# Altium schematic sheet USB.SchDoc
size A; SheetNumber: 4; SheetTotal: 6
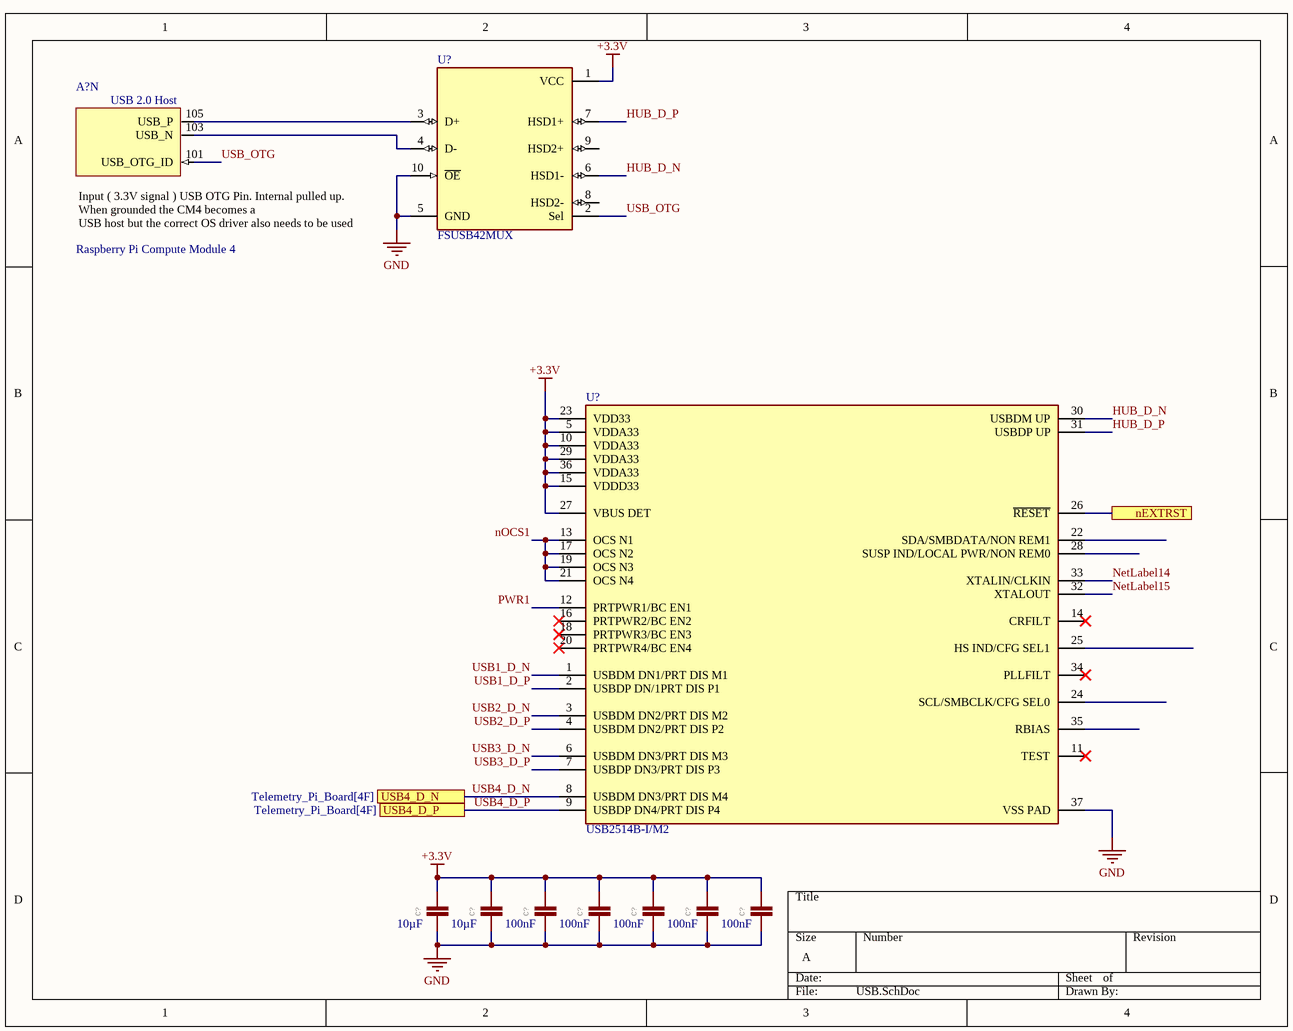
[diagram p0: USB.SchDoc]

## Parts
(Parts that share a designator on the sheet are numbered #1, #2 ... from top to bottom, then left to right.)
A?  Raspberry Pi Compute Module 4  [CM4-F40C-100DS-0.4v_1.5mm_0mm]  (part N of 21)  (no BOM)
C?#1  CAPACITANCE: 10µF  [0603-CAP]  (hidden comment: Capacitor, Non-Polarized  VJ...1BC Series Datasheet  Samsung Datasheet  Walsin Datasheet  GRM188R61A226ME15D  GRM188R61E106MA73D  885012006013  2220Y6300105KXTWS2  Yageo Class 2, X5R  TDK C Series  AVX Automotive MLCC   KEMET X7R Series  Kyocera AVX  GRM21BR61H  C1812W104KDRACTU)
C?#2  CAPACITANCE: 10µF  [0603-CAP]  (hidden comment: Capacitor, Non-Polarized  VJ...1BC Series Datasheet  Samsung Datasheet  Walsin Datasheet  GRM188R61A226ME15D  GRM188R61E106MA73D  885012006013  2220Y6300105KXTWS2  Yageo Class 2, X5R  TDK C Series  AVX Automotive MLCC   KEMET X7R Series  Kyocera AVX  GRM21BR61H  C1812W104KDRACTU)
C?#3  CAPACITANCE: 100nF  [0603-CAP]  (hidden comment: Capacitor, Non-Polarized  VJ...1BC Series Datasheet  Samsung Datasheet  Walsin Datasheet  GRM188R61A226ME15D  GRM188R61E106MA73D  885012006013  2220Y6300105KXTWS2  Yageo Class 2, X5R  TDK C Series  AVX Automotive MLCC   KEMET X7R Series  Kyocera AVX  GRM21BR61H  C1812W104KDRACTU)
C?#4  CAPACITANCE: 100nF  [0603-CAP]  (hidden comment: Capacitor, Non-Polarized  VJ...1BC Series Datasheet  Samsung Datasheet  Walsin Datasheet  GRM188R61A226ME15D  GRM188R61E106MA73D  885012006013  2220Y6300105KXTWS2  Yageo Class 2, X5R  TDK C Series  AVX Automotive MLCC   KEMET X7R Series  Kyocera AVX  GRM21BR61H  C1812W104KDRACTU)
C?#5  CAPACITANCE: 100nF  [0603-CAP]  (hidden comment: Capacitor, Non-Polarized  VJ...1BC Series Datasheet  Samsung Datasheet  Walsin Datasheet  GRM188R61A226ME15D  GRM188R61E106MA73D  885012006013  2220Y6300105KXTWS2  Yageo Class 2, X5R  TDK C Series  AVX Automotive MLCC   KEMET X7R Series  Kyocera AVX  GRM21BR61H  C1812W104KDRACTU)
C?#6  CAPACITANCE: 100nF  [0603-CAP]  (hidden comment: Capacitor, Non-Polarized  VJ...1BC Series Datasheet  Samsung Datasheet  Walsin Datasheet  GRM188R61A226ME15D  GRM188R61E106MA73D  885012006013  2220Y6300105KXTWS2  Yageo Class 2, X5R  TDK C Series  AVX Automotive MLCC   KEMET X7R Series  Kyocera AVX  GRM21BR61H  C1812W104KDRACTU)
C?#7  CAPACITANCE: 100nF  [0603-CAP]  (hidden comment: Capacitor, Non-Polarized  VJ...1BC Series Datasheet  Samsung Datasheet  Walsin Datasheet  GRM188R61A226ME15D  GRM188R61E106MA73D  885012006013  2220Y6300105KXTWS2  Yageo Class 2, X5R  TDK C Series  AVX Automotive MLCC   KEMET X7R Series  Kyocera AVX  GRM21BR61H  C1812W104KDRACTU)
U?#1  FSUSB42MUX  [FP-846AP-MFG]
U?#2  USB2514B-I/M2  [FP-36SQFN-3706-6x6B-IPC_B]

## Ports
nEXTRST, USB4_D_N (see Telemetry_Pi_Board[4F]), USB4_D_P (see Telemetry_Pi_Board[4F])

## Nets
+3.3V: C?#1.1 C?#2.1 C?#3.1 C?#4.1 C?#5.1 C?#6.1 C?#7.1 U?#1.1(VCC) U?#2.5(VDDA33) U?#2.10(VDDA33) U?#2.15(VDDD33) U?#2.23(VDD33) U?#2.27(VBUS_DET) U?#2.29(VDDA33) U?#2.36(VDDA33)
GND: C?#1.2 C?#2.2 C?#3.2 C?#4.2 C?#5.2 C?#6.2 C?#7.2 U?#1.5(GND) U?#1.10(~{OE}) U?#2.37(VSS_PAD)
HUB_D_N: U?#1.6(HSD1-) U?#2.30(USBDM_UP)
HUB_D_P: U?#1.7(HSD1+) U?#2.31(USBDP_UP)
NetLabel14: U?#2.33(XTALIN/CLKIN)
NetLabel15: U?#2.32(XTALOUT)
nEXTRST: U?#2.26(~{RESET}) ; port nEXTRST
nOCS1: U?#2.13(OCS_N1) U?#2.17(OCS_N2) U?#2.19(OCS_N3) U?#2.21(OCS_N4)
PWR1: U?#2.12(PRTPWR1/BC_EN1)
USB1_D_N: U?#2.1(USBDM_DN1/PRT_DIS_M1)
USB1_D_P: U?#2.2(USBDP_DN/1PRT_DIS_P1)
USB2_D_N: U?#2.3(USBDM_DN2/PRT_DIS_M2)
USB2_D_P: U?#2.4(USBDM_DN2/PRT_DIS_P2)
USB3_D_N: U?#2.6(USBDM_DN3/PRT_DIS_M3)
USB3_D_P: U?#2.7(USBDP_DN3/PRT_DIS_P3)
USB4_D_N: U?#2.8(USBDM_DN3/PRT_DIS_M4) ; port USB4_D_N
USB4_D_P: U?#2.9(USBDP_DN4/PRT_DIS_P4) ; port USB4_D_P
USB_OTG: A?.101(USB_OTG_ID) U?#1.2(Sel)
NetA?_103: A?.103(USB_N) U?#1.4(D-)
NetA?_105: A?.105(USB_P) U?#1.3(D+)

Not connected (* = marked no-connect by the designer): U?#1 8(HSD2-) 9(HSD2+); U?#2 11(TEST)* 14(CRFILT)* 16(PRTPWR2/BC_EN2)* 18(PRTPWR3/BC_EN3)* 20(PRTPWR4/BC_EN4)* 22(SDA/SMBDATA/NON_REM1) 24(SCL/SMBCLK/CFG_SEL0) 25(HS_IND/CFG_SEL1) 28(SUSP_IND/LOCAL_PWR/NON_REM0) 34(PLLFILT)* 35(RBIAS)

## Notes on the sheet
- (in symbol CM4, part N) USB 2.0 Host; Input ( 3.3V signal ) USB OTG Pin. Internal pulled up. When grounded the CM4 becomes a / USB host but the correct OS driver also needs to be used

## Library data of the parts
A? = CM4: Raspberry Pi Compute Module 4 by Amornthep Phunsin
C?#1 C?#2 = CAPACITOR_?_*0603: MPN: CC0603KRX7R0BB104; MPN: CC0603KRX7R0BB103; MPN: C0603C823K8RACTU; MANUFACTURER: Vishay Vitramon; MPN: VJ0603Y104JXQPW1BC; MPN: VJ0603Y224JXQCW1BC; MPN: CC0603KRX7R6BB103; MPN: VJ0603A150FXQPW1BC; MPN: CC0603KRX7R6BB105; MANUFACTURER: Murata Electronics; MANUFACTURER: Würth Elektronik; MPN: 885012006016; MPN: 885012206012; MANUFACTURER: Samsung Electro-Mechanics; MPN: CL10A475KP8NNNC; MPN: C0603C683K8RACTU; MPN: 0201ZA820JAT2A; MPN: CL10B104KA8NNNC; MANUFACTURER: Walsin Technology Corporation; MPN: 0603B224K250CT; MPN: CC0603KRX7R8BB122; MPN: CL10B105KA8NNNC; MANUFACTURER: TDK Corporation; MPN: C1608X5R1E475K080AC; MPN: 06033C473K4Z2A; MANUFACTURER: Taiyo Yuden; MPN: GMK107B7104KAHT; MPN: C1608X7R1V224K080AB; MPN: C1608X7R1V105K080AE; MPN: CC0603KRX7R9BB104; MPN: C1608C0G1H103J080AA; MPN: UMK107BJ105KA-T; MPN: CL10B471JB8NNNC; GateName_1: G$1; DeviceName: 0603; DKPN: 311-1523-1-ND; MOPN: 603-CC603KRX7R0BB104; TOLERANCE: 10%; VOLTAGE: 100V; CAPACITANCE: 10nF; DKPN: 311-1788-1-ND; MOPN: 603-CC603KRX7R0BB103; CAPACITANCE: 0.082µF; DKPN: 399-17417-2-ND; MOPN: 80-C0603C823K8R; VOLTAGE: 10V; CAPACITANCE: 0.1µF; DKPN: 720-1688-1-ND; MOPN: 77-VJ0603Y104JXQPBC; TOLERANCE: 5%; CAPACITANCE: 0.22µF; DKPN: 720-VJ0603Y224JXQCW1BCTR-ND; MOPN: 77-VJ0603Y224JXQCBC; DKPN: 311-4054-1-ND; MOPN: 603-CC603KRX7R6BB103; CAPACITANCE: 15pF; DKPN: 720-VJ0603A150FXQPW1BCCT-ND; MOPN: 77-VJ0603A150FXQPBC; TOLERANCE: 1%; CAPACITANCE: 1µF; DKPN: 311-1796-1-ND; MOPN: 603-CC603KRX7R6BB105; CAPACITANCE: 22µF; DKPN: 490-10476-1-ND; MOPN: 81-GRM188R61A226ME5D; TOLERANCE: 20%; CAPACITANCE: 3.3nF; DKPN: 732-7759-1-ND; MOPN: 710-885012006016; CAPACITANCE: 4.7nF; DKPN: 732-7931-1-ND; MOPN: 710-885012206012; CAPACITANCE: 4.7µF; DKPN: 1276-1044-1-ND; MOPN: 187-CL10A475KP8NNNC; CAPACITANCE: 680pF; DKPN: 732-7757-1-ND; MOPN: 710-885012006013; CAPACITANCE: 68nF; DKPN: 399-C0603C683K8RAC7867CT-ND; MOPN: 80-C0603C683K8R; CAPACITANCE: 82pF; DKPN: 478-1025-1-ND; MOPN: 581-0201ZA820JAT2A; DKPN: 1276-1006-1-ND; MOPN: 187-CL10B104KA8NNNC; VOLTAGE: 25V; DKPN: 1292-1420-1-ND; MOPN: 791-0603B224K250CT; CAPACITANCE: 1.2nF; DKPN: 311-4079-2-ND; MOPN: 603-CC603KRX7R8BB122; DKPN: 490-7202-1-ND; MOPN: 81-GRM188R61E106MA3D; DKPN: 1276-1184-1-ND; MOPN: 187-CL10B105KA8NNNC; CAPACITANCE: 4.7uF; DKPN: 445-9050-1-ND; MOPN: 810-C1608X5R1E475K; CAPACITANCE: 47nF; DKPN: 478-6340-1-ND; MOPN: 581-06033C473K42ZA; DKPN: 587-3354-1-ND; MOPN: 963-GMK107B7104KAHT; VOLTAGE: 35V; DKPN: 445-14239-1-ND; MOPN: 810-C1608X7R1V224K0B; DKPN: 445-173625-1-ND; MOPN: 810-C1608X7R1V105KAE; DKPN: 311-1344-1-ND; MOPN: 603-CC603KRX7R9BB104; VOLTAGE: 50V; DKPN: 445-7404-1-ND; MOPN: 810-C1608C0G1H103J; CAPACITANCE: 1uF; DKPN: 587-2400-2-ND; MOPN: 963-UMK107BJ105KA-T; CAPACITANCE: 470pF; DKPN: 1276-2058-1-ND; MOPN: 187-CL10B471JB8NNNC; CAPACITANCE: 47pF; DKPN: 445-12417-1-ND; MOPN: CGA3E2NP01H470J080AA; SymbolName_1: CAPACITOR; LibraryName: HyTechDevices; DeviceSetName: CAPACITOR_?_*; Package: 0603-CAP; MANUFACTURER: Yageo; MANUFACTURER: KEMET; MPN: GRM188R61A226ME15D; MPN: 885012006013; MANUFACTURER: Kyocera AVX; MANUFACTURER: YAGEO; MPN: GRM188R61E106MA73D; MPN: CGA3E2NP01H470J080AA
C?#3-C?#7 = CAPACITOR_?_*0603: MPN: CC0603KRX7R0BB104; MPN: CC0603KRX7R0BB103; MPN: C0603C823K8RACTU; MANUFACTURER: Vishay Vitramon; MPN: VJ0603Y104JXQPW1BC; MPN: VJ0603Y224JXQCW1BC; MPN: CC0603KRX7R6BB103; MPN: VJ0603A150FXQPW1BC; MPN: CC0603KRX7R6BB105; MANUFACTURER: Murata Electronics; MANUFACTURER: Würth Elektronik; MPN: 885012006016; MPN: 885012206012; MANUFACTURER: Samsung Electro-Mechanics; MPN: CL10A475KP8NNNC; MPN: C0603C683K8RACTU; MPN: 0201ZA820JAT2A; MPN: CL10B104KA8NNNC; MANUFACTURER: Walsin Technology Corporation; MPN: 0603B224K250CT; MPN: CC0603KRX7R8BB122; MPN: CL10B105KA8NNNC; MANUFACTURER: TDK Corporation; MPN: C1608X5R1E475K080AC; MPN: 06033C473K4Z2A; MANUFACTURER: Taiyo Yuden; MPN: GMK107B7104KAHT; MPN: C1608X7R1V224K080AB; MPN: C1608X7R1V105K080AE; MPN: CC0603KRX7R9BB104; MPN: C1608C0G1H103J080AA; MPN: UMK107BJ105KA-T; MPN: CL10B471JB8NNNC; GateName_1: G$1; DeviceName: 0603; DKPN: 311-1523-1-ND; MOPN: 603-CC603KRX7R0BB104; TOLERANCE: 10%; VOLTAGE: 100V; CAPACITANCE: 10nF; DKPN: 311-1788-1-ND; MOPN: 603-CC603KRX7R0BB103; CAPACITANCE: 0.082µF; DKPN: 399-17417-2-ND; MOPN: 80-C0603C823K8R; VOLTAGE: 10V; CAPACITANCE: 0.1µF; DKPN: 720-1688-1-ND; MOPN: 77-VJ0603Y104JXQPBC; TOLERANCE: 5%; CAPACITANCE: 0.22µF; DKPN: 720-VJ0603Y224JXQCW1BCTR-ND; MOPN: 77-VJ0603Y224JXQCBC; DKPN: 311-4054-1-ND; MOPN: 603-CC603KRX7R6BB103; CAPACITANCE: 15pF; DKPN: 720-VJ0603A150FXQPW1BCCT-ND; MOPN: 77-VJ0603A150FXQPBC; TOLERANCE: 1%; CAPACITANCE: 1µF; DKPN: 311-1796-1-ND; MOPN: 603-CC603KRX7R6BB105; CAPACITANCE: 22µF; DKPN: 490-10476-1-ND; MOPN: 81-GRM188R61A226ME5D; TOLERANCE: 20%; CAPACITANCE: 3.3nF; DKPN: 732-7759-1-ND; MOPN: 710-885012006016; CAPACITANCE: 4.7nF; DKPN: 732-7931-1-ND; MOPN: 710-885012206012; CAPACITANCE: 4.7µF; DKPN: 1276-1044-1-ND; MOPN: 187-CL10A475KP8NNNC; CAPACITANCE: 680pF; DKPN: 732-7757-1-ND; MOPN: 710-885012006013; CAPACITANCE: 68nF; DKPN: 399-C0603C683K8RAC7867CT-ND; MOPN: 80-C0603C683K8R; CAPACITANCE: 82pF; DKPN: 478-1025-1-ND; MOPN: 581-0201ZA820JAT2A; DKPN: 1276-1006-1-ND; MOPN: 187-CL10B104KA8NNNC; VOLTAGE: 25V; DKPN: 1292-1420-1-ND; MOPN: 791-0603B224K250CT; CAPACITANCE: 1.2nF; DKPN: 311-4079-2-ND; MOPN: 603-CC603KRX7R8BB122; CAPACITANCE: 10µF; DKPN: 490-7202-1-ND; MOPN: 81-GRM188R61E106MA3D; DKPN: 1276-1184-1-ND; MOPN: 187-CL10B105KA8NNNC; CAPACITANCE: 4.7uF; DKPN: 445-9050-1-ND; MOPN: 810-C1608X5R1E475K; CAPACITANCE: 47nF; DKPN: 478-6340-1-ND; MOPN: 581-06033C473K42ZA; DKPN: 587-3354-1-ND; MOPN: 963-GMK107B7104KAHT; VOLTAGE: 35V; DKPN: 445-14239-1-ND; MOPN: 810-C1608X7R1V224K0B; DKPN: 445-173625-1-ND; MOPN: 810-C1608X7R1V105KAE; DKPN: 311-1344-1-ND; MOPN: 603-CC603KRX7R9BB104; VOLTAGE: 50V; DKPN: 445-7404-1-ND; MOPN: 810-C1608C0G1H103J; CAPACITANCE: 1uF; DKPN: 587-2400-2-ND; MOPN: 963-UMK107BJ105KA-T; CAPACITANCE: 470pF; DKPN: 1276-2058-1-ND; MOPN: 187-CL10B471JB8NNNC; CAPACITANCE: 47pF; DKPN: 445-12417-1-ND; MOPN: CGA3E2NP01H470J080AA; SymbolName_1: CAPACITOR; LibraryName: HyTechDevices; DeviceSetName: CAPACITOR_?_*; Package: 0603-CAP; MANUFACTURER: Yageo; MANUFACTURER: KEMET; MPN: GRM188R61A226ME15D; MPN: 885012006013; MANUFACTURER: Kyocera AVX; MANUFACTURER: YAGEO; MPN: GRM188R61E106MA73D; MPN: CGA3E2NP01H470J080AA
U?#1 = CMP-07103-000004-1: IC USB SWITCH DPDT 10MSOP; Voltage: 4.3V; Current: 100mA; Number of Inputs: 2; Supply Type: Single; Number of Outputs: 4; Data Rate: 480Mbps; On-State Resistance: 6.5R; Min Supply Voltage: 3V; Package Quantity: 1; Length: 3mm; Radiation Hardening: No; Number of Pins: 10; Width: 3mm; Number of Channels: 2; REACH SVHC: No SVHC; Lead Free: Lead Free; Max Operating Temperature: 85°C; Min Operating Temperature: -40°C; Packaging: Tape and Reel; Throw Configuration: DPDT; Operating Supply Voltage: 4.3V; Max Supply Voltage: 4.3V; Mount: Surface Mount; Case/Package: MSOP; Weight: 0.1125g; Height: 0.85mm
U?#2 = CMP-06284-000036-1: IC HUB CTLR 4PORT USB 2.0 HS 36S; Min Supply Voltage: 3V; Number of Ports: 4; Operating Supply Current: 70mA; Data Rate: 480Mbps; USB Standard: USB 2.0; Max Supply Voltage: 3.6V; REACH SVHC: No SVHC; Packaging: Tray; Min Operating Temperature: -40°C; RoHS Compliant: Yes; Number of Pins: 36; Interface: USB; Max Operating Temperature: 85°C; Lead Free: Lead Free